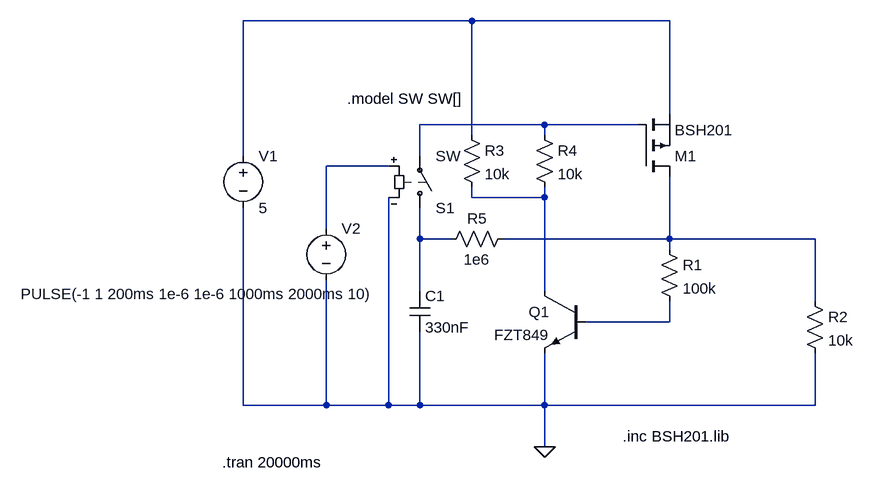
[diagram p0: schematic on_off_mom.asc]
on_off_mom.asc, the LTspice schematic file:
Version 4
SHEET 1 956 680
WIRE 64 -336 -288 -336
WIRE 368 -336 64 -336
WIRE 368 -192 368 -336
WIRE 176 -176 -16 -176
WIRE 320 -176 176 -176
WIRE 64 -160 64 -336
WIRE 176 -160 176 -176
WIRE -288 -128 -288 -336
WIRE -16 -128 -16 -176
WIRE -64 -112 -160 -112
WIRE 64 -64 64 -80
WIRE 176 -64 176 -80
WIRE 176 -64 64 -64
WIRE -160 -16 -160 -112
WIRE -16 0 -16 -48
WIRE 32 0 -16 0
WIRE 368 0 368 -96
WIRE 368 0 112 0
WIRE 592 0 368 0
WIRE 368 16 368 0
WIRE -16 80 -16 0
WIRE 176 80 176 -64
WIRE 592 96 592 0
WIRE 368 128 368 96
WIRE 368 128 240 128
WIRE -288 256 -288 -48
WIRE -160 256 -160 64
WIRE -160 256 -288 256
WIRE -64 256 -64 -64
WIRE -64 256 -160 256
WIRE -16 256 -16 144
WIRE -16 256 -64 256
WIRE 176 256 176 176
WIRE 176 256 -16 256
WIRE 592 256 592 176
WIRE 592 256 176 256
WIRE 176 320 176 256
FLAG 176 320 0
SYMBOL npn 240 80 M0
SYMATTR InstName Q1
SYMATTR Value FZT849
SYMBOL pmos 320 -96 M180
SYMATTR InstName M1
SYMATTR Value BSH201
SYMATTR Prefix X
SYMBOL res 352 0 R0
SYMATTR InstName R1
SYMATTR Value 100k
SYMBOL res 576 80 R0
SYMATTR InstName R2
SYMATTR Value 10k
SYMBOL res 48 -176 R0
SYMATTR InstName R3
SYMATTR Value 10k
SYMBOL res 160 -176 R0
SYMATTR InstName R4
SYMATTR Value 10k
SYMBOL cap -32 80 R0
SYMATTR InstName C1
SYMATTR Value 330nF
SYMBOL res 128 -16 R90
WINDOW 0 0 56 VBottom 2
WINDOW 3 32 56 VTop 2
SYMATTR InstName R5
SYMATTR Value 1e6
SYMBOL voltage -288 -144 R0
WINDOW 123 0 0 Left 2
WINDOW 39 0 0 Left 2
SYMATTR InstName V1
SYMATTR Value 5
SYMBOL sw -16 -32 M180
SYMATTR InstName S1
SYMBOL voltage -160 -32 R0
WINDOW 3 -470 117 Left 2
WINDOW 123 0 0 Left 2
WINDOW 39 0 0 Left 2
SYMATTR Value PULSE(-1 1 200ms 1e-6 1e-6 1000ms 2000ms 10)
SYMATTR InstName V2
TEXT -320 344 Left 2 !.tran 20000ms
TEXT -128 -216 Left 2 !.model SW SW[]
TEXT 296 304 Left 2 !.inc BSH201.lib

The netlist it stands for:
* on_off_mom.asc
Q1 N004 N007 0 0 FZT849
XM1 N006 N002 N001 BSH201  ; pins D G S
R1 N006 N007 100k
R2 N006 0 10k
R3 N001 N004 10k
R4 N002 N004 10k
C1 N005 0 330nF
R5 N006 N005 1e6
V1 N001 0 5
S1 N005 N002 N003 0 SW
V2 N003 0 PULSE(-1 1 200ms 1e-6 1e-6 1000ms 2000ms 10)
.model NPN NPN
.model PNP PNP
.lib standard.bjt
.tran 20000ms
.model SW SW[]
.inc BSH201.lib
.backanno
.end